# EAGLE design integrated-pico-fighting-board-gp2040-layout-Version3.0 (EAGLE 9.6.2)

## Sheet 1 of 2: MAIN CONNECTORS FOR THE PCB - Jasen Hicks
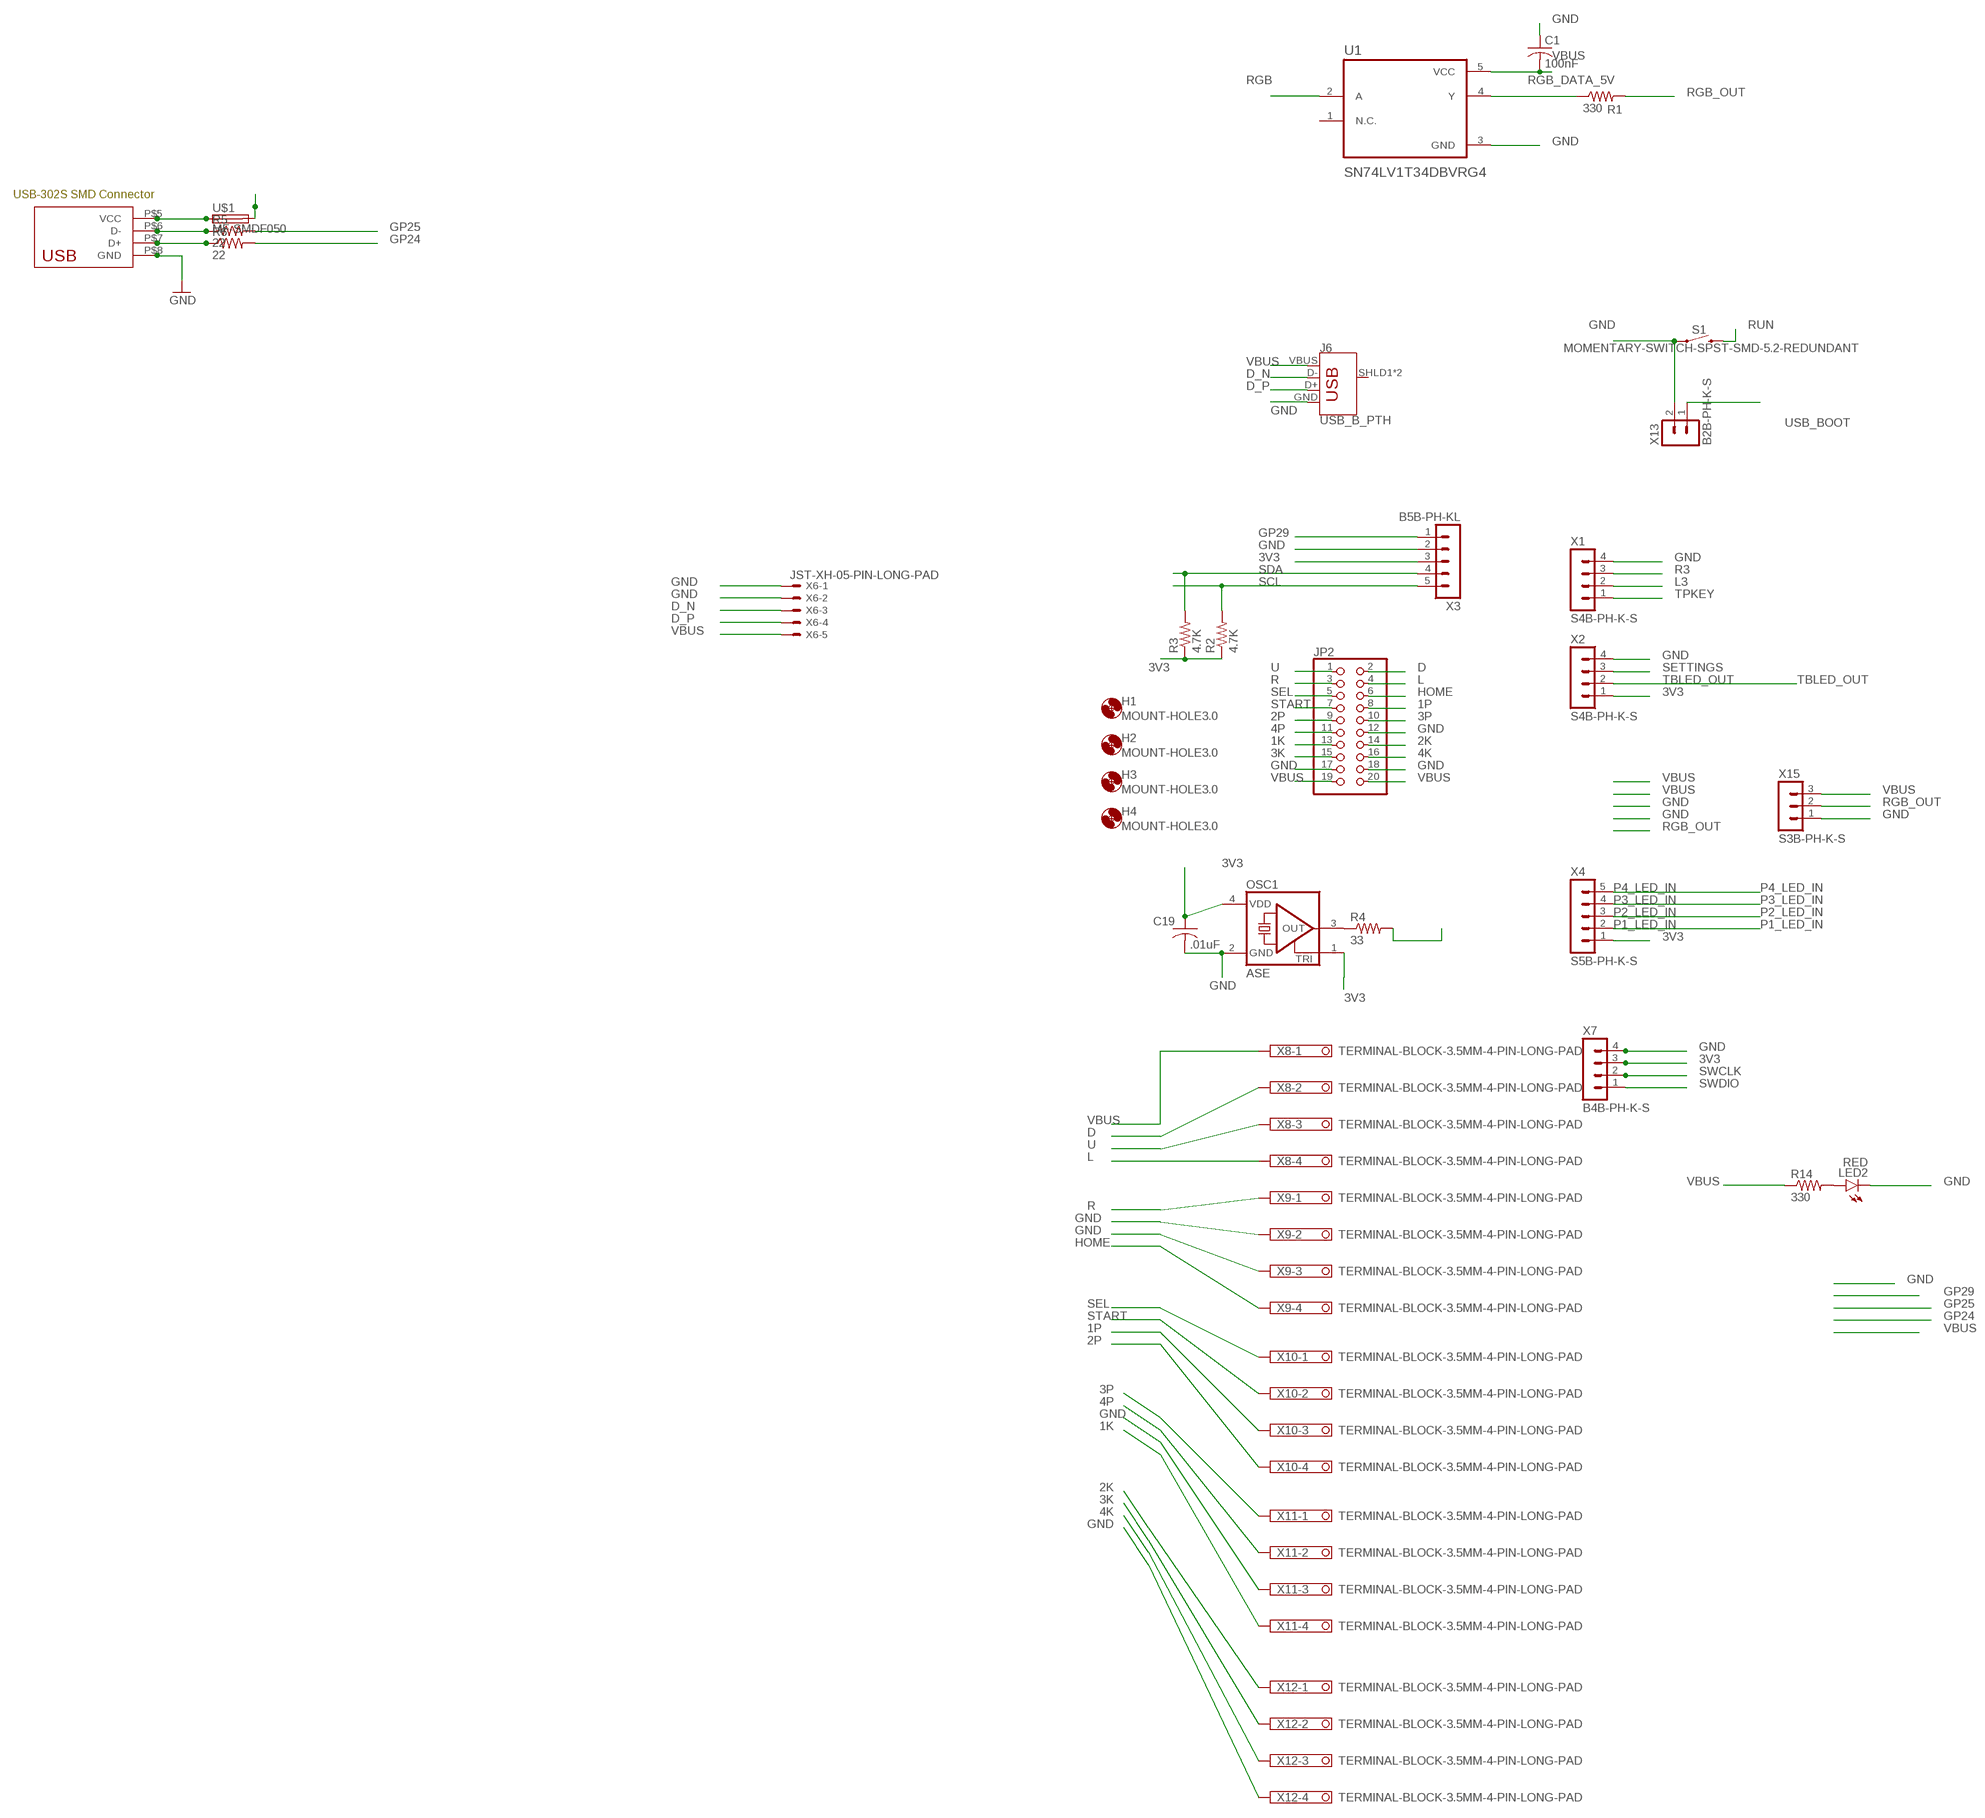
[diagram p0: schematic, sheet 1]

### Parts
C1  100nF  C-USC0603K  [C0603K]
C19  .01uF  C-USC0402K  [C0402K]
H1  MOUNT-HOLE3.0  [3,0]
H2  MOUNT-HOLE3.0  [3,0]
H3  MOUNT-HOLE3.0  [3,0]
H4  MOUNT-HOLE3.0  [3,0]
J6  USB_B_PTH  [USB-B-PTH]
JP2  PINHD-2X10  [2X10]
LED2  RED  LEDCHIP-LED0603  [CHIP-LED0603]
OSC1  ASE  [ASE]
R1  330  R-US_R0603  [R0603]
R2  4.7K  R-US_R0603  [R0603]
R3  4.7K  R-US_R0603  [R0603]
R4  33  R-US_R0402  [R0402]
R5  22  R-US_R0805  [R0805]
R6  22  R-US_R0805  [R0805]
R14  330  R-US_R0603  [R0603]
S1  MOMENTARY-SWITCH-SPST-SMD-5.2-REDUNDANT  [TACTILE_SWITCH_SMD_5.2MM]
U1  SN74LV1T34DBVRG4  [SOT95P280X145-5N]
U$1  MF-SMDF050  [MF-SMDF050]
U$2  USB-302S  [USB-302S]
X1  S4B-PH-K-S  [S4B-PH-K-S]
X2  S4B-PH-K-S  [S4B-PH-K-S]
X3  B5B-PH-KL  [B5B-PH-K-S]
X4  S5B-PH-K-S  [S5B-PH-K-S]
X6  JST-XH-05-PIN-LONG-PAD  [JST-XH-05-PACKAGE-LONG-PAD]
X7  B4B-PH-K-S  [B4B-PH-K-S]
X8  TERMINAL-BLOCK-3.5MM-4-PIN-LONG-PAD  [TERMINAL-BLOCK-4-PIN-3.5MM-LONG-PAD]
X9  TERMINAL-BLOCK-3.5MM-4-PIN-LONG-PAD  [TERMINAL-BLOCK-4-PIN-3.5MM-LONG-PAD]
X10  TERMINAL-BLOCK-3.5MM-4-PIN-LONG-PAD  [TERMINAL-BLOCK-4-PIN-3.5MM-LONG-PAD]
X11  TERMINAL-BLOCK-3.5MM-4-PIN-LONG-PAD  [TERMINAL-BLOCK-4-PIN-3.5MM-LONG-PAD]
X12  TERMINAL-BLOCK-3.5MM-4-PIN-LONG-PAD  [TERMINAL-BLOCK-4-PIN-3.5MM-LONG-PAD]
X13  B2B-PH-K-S  [B2B-PH-K-S]
X15  S3B-PH-K-S  [S3B-PH-K-S]

### Nets
1K: JP2.13 X11.4 ; also sheet 2
1P: JP2.8 X10.3 ; also sheet 2
2K: JP2.14 X12.1 ; also sheet 2
2P: JP2.9 X10.4 ; also sheet 2
3K: JP2.15 X12.2 ; also sheet 2
3P: JP2.10 X11.1 ; also sheet 2
3V3: C19.1 OSC1.1(TRI) OSC1.4(VDD) R2.1 R3.1 X2.1 X3.3 X4.1 X7.3 ; also sheet 2
4K: JP2.16 X12.3 ; also sheet 2
4P: JP2.11 X11.2 ; also sheet 2
D: JP2.2 X8.2 ; also sheet 2
D_N [diff pairs]: J6.D- X6.3 ; also sheet 2
D_P [diff pairs]: J6.D+ X6.4 ; also sheet 2
GND: C1.1 C19.2 J6.GND JP2.12 JP2.17 JP2.18 LED2.C OSC1.2(GND) S1.1 S1.2 U1.3(GND) U$2.P$8(GND) X1.4 X2.4 X3.2 X6.1 X6.2 X7.4 X9.2 X9.3 X11.3 X12.4 X13.2 X15.1 ; also sheet 2
GP24: R6.2 ; also sheet 2
GP25: R5.2 ; also sheet 2
GP29: X3.1 ; also sheet 2
HOME: JP2.6 X9.4 ; also sheet 2
L: JP2.4 X8.4 ; also sheet 2
L3: X1.2 ; also sheet 2
N$1: OSC1.3(OUT) R4.1
N$2: LED2.A R14.2
N$3: U$1.1 U$2.P$5(VCC)
N$4: R5.1 U$2.P$6(D-)
N$5: R6.1 U$2.P$7(D+)
P1_LED_IN: X4.2 ; also sheet 2
P2_LED_IN: X4.3 ; also sheet 2
P3_LED_IN: X4.4 ; also sheet 2
P4_LED_IN: X4.5 ; also sheet 2
R: JP2.3 X9.1 ; also sheet 2
R3: X1.3 ; also sheet 2
RGB: U1.2(A) ; also sheet 2
RGB_DATA_5V: R1.1 U1.4(Y)
RGB_OUT: R1.2 X15.2
RUN: S1.3 S1.4 ; also sheet 2
SCL: R2.2 X3.5 ; also sheet 2
SDA: R3.2 X3.4 ; also sheet 2
SEL: JP2.5 X10.1 ; also sheet 2
SETTINGS: X2.3 ; also sheet 2
START: JP2.7 X10.2 ; also sheet 2
SWCLK: X7.2 ; also sheet 2
SWDIO: X7.1 ; also sheet 2
TBLED_OUT: X2.2 ; also sheet 2
TPKEY: X1.1 ; also sheet 2
U: JP2.1 X8.3 ; also sheet 2
USB_BOOT: X13.1 ; also sheet 2
VBUS: C1.2 J6.VBUS JP2.19 JP2.20 R14.1 U1.5(VCC) U$1.2 X6.5 X8.1 X15.3 ; also sheet 2
XIN: R4.2 ; also sheet 2
Unconnected: J6.SHLD1(SHIELD) J6.SHLD2(SHIELD) U1.1(N.C.)

## Sheet 2 of 2: RP2040 Minimal Design based on https://datasheets.raspberrypi.com/rp2040/hardware-design-with-rp2040.pdf
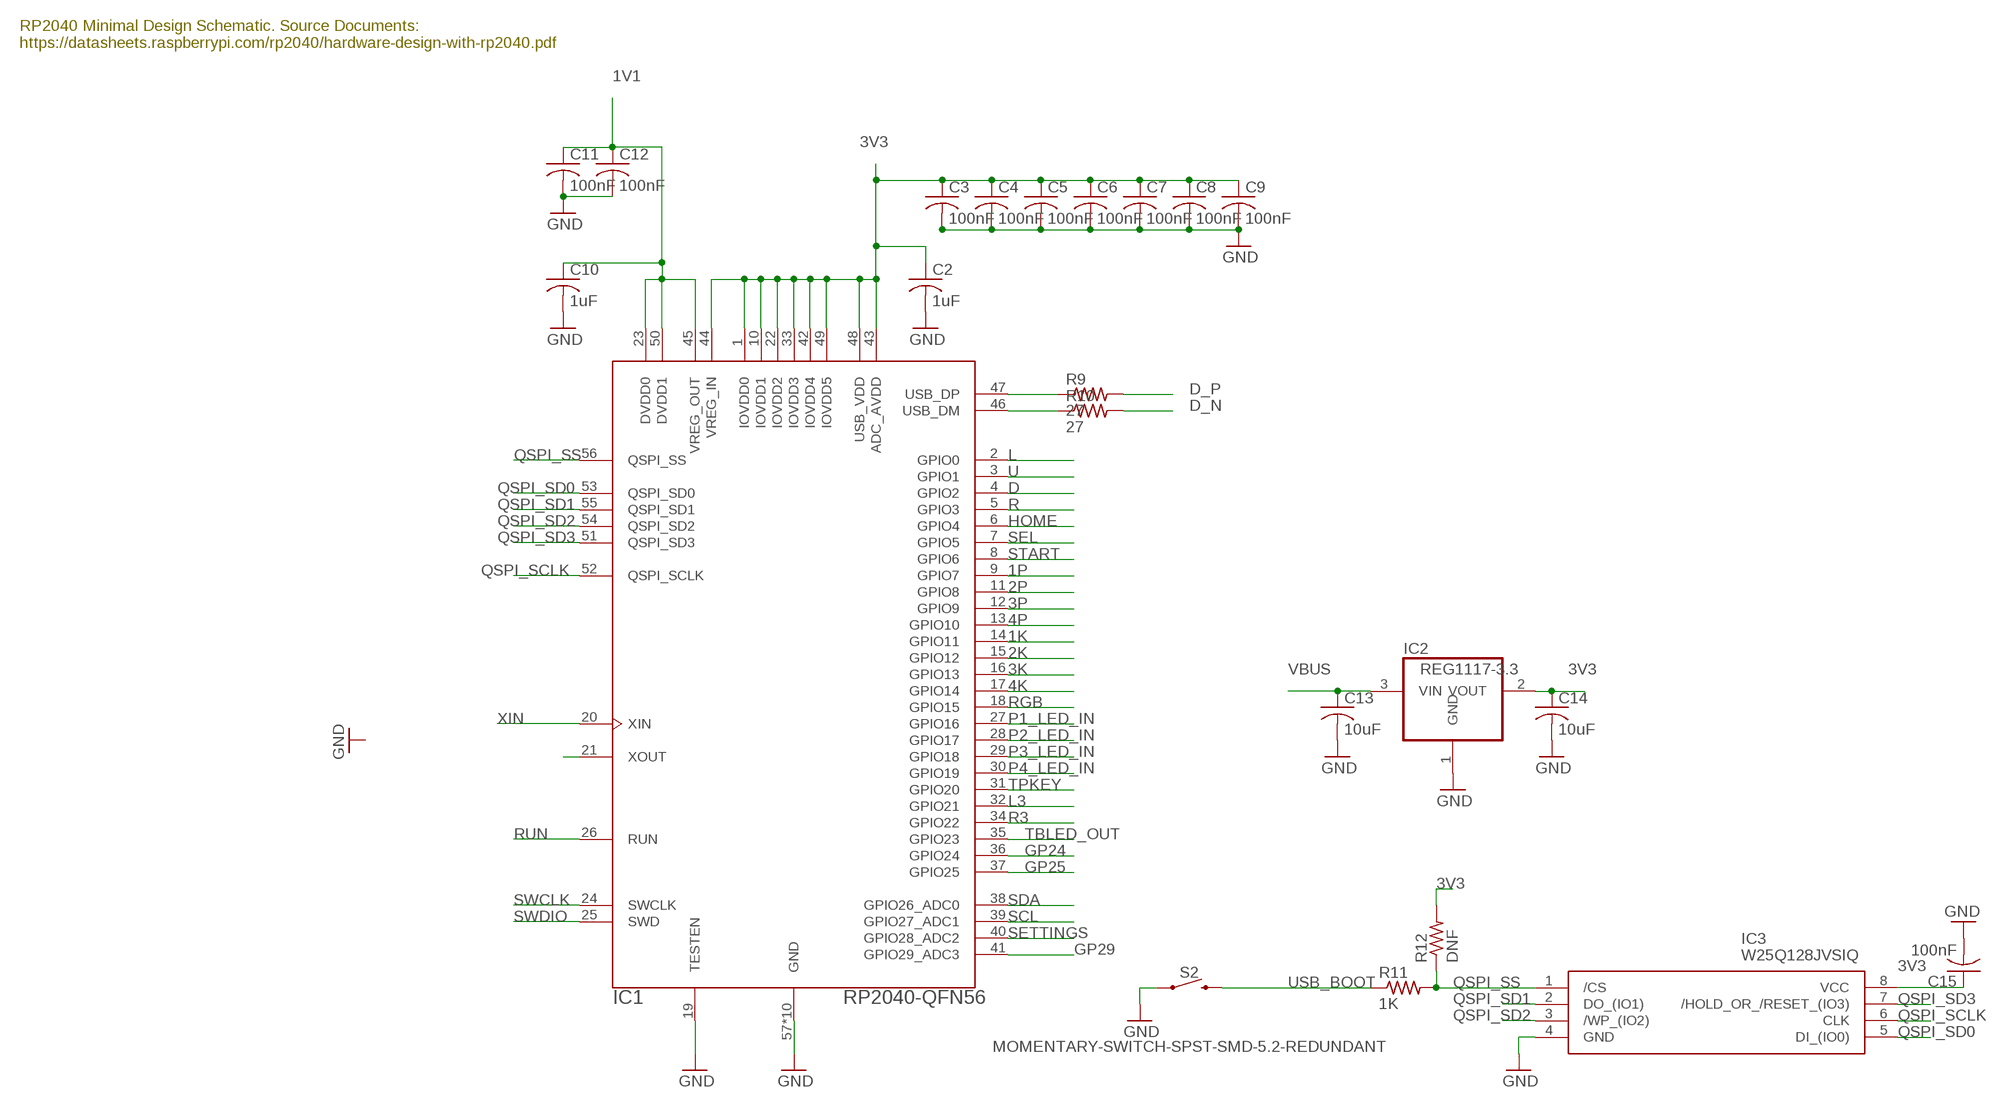
[diagram p1: schematic, sheet 2]

### Parts
C2  1uF  C-USC0402K  [C0402K]
C3  100nF  C-USC0402K  [C0402K]
C4  100nF  C-USC0402K  [C0402K]
C5  100nF  C-USC0402K  [C0402K]
C6  100nF  C-USC0402K  [C0402K]
C7  100nF  C-USC0402K  [C0402K]
C8  100nF  C-USC0402K  [C0402K]
C9  100nF  C-USC0402K  [C0402K]
C10  1uF  C-USC0402K  [C0402K]
C11  100nF  C-USC0402K  [C0402K]
C12  100nF  C-USC0402K  [C0402K]
C13  10uF  C-USC0402K  [C0402K]
C14  10uF  C-USC0402K  [C0402K]
C15  100nF  C-USC0402K  [C0402K]
IC1  RP2040-QFN56  [RP2040-QFN-56]
IC2  REG1117-3.3  REG1117  [SOT223]
IC3  W25Q128JVSIQ  [SOIC127P790X216-8N]
R9  27  R-US_R0402  [R0402]
R10  27  R-US_R0402  [R0402]
R11  1K  R-US_R0402  [R0402]
R12  DNF  R-US_R0402  [R0402]
S2  MOMENTARY-SWITCH-SPST-SMD-5.2-REDUNDANT  [TACTILE_SWITCH_SMD_5.2MM]

### Nets
1K: IC1.14(GPIO11) ; also sheet 1
1P: IC1.9(GPIO7) ; also sheet 1
1V1: C10.1 C11.1 C12.1 IC1.23(DVDD0) IC1.45(VREG_OUT) IC1.50(DVDD1)
2K: IC1.15(GPIO12) ; also sheet 1
2P: IC1.11(GPIO8) ; also sheet 1
3K: IC1.16(GPIO13) ; also sheet 1
3P: IC1.12(GPIO9) ; also sheet 1
3V3: C2.1 C3.1 C4.1 C5.1 C6.1 C7.1 C8.1 C9.1 C14.1 C15.1 IC1.1(IOVDD0) IC1.10(IOVDD1) IC1.22(IOVDD2) IC1.33(IOVDD3) IC1.42(IOVDD4) IC1.43(ADC_AVDD) IC1.44(VREG_IN) IC1.48(USB_VDD) IC1.49(IOVDD5) IC2.2(VOUT) IC3.8(VCC) R12.2 ; also sheet 1
4K: IC1.17(GPIO14) ; also sheet 1
4P: IC1.13(GPIO10) ; also sheet 1
D: IC1.4(GPIO2) ; also sheet 1
D_N [diff pairs]: R10.2 ; also sheet 1
D_P [diff pairs]: R9.2 ; also sheet 1
GND: C2.2 C3.2 C4.2 C5.2 C6.2 C7.2 C8.2 C9.2 C10.2 C11.2 C12.2 C13.2 C14.2 C15.2 IC1.19(TESTEN) IC1.57(GND) IC1.58(GND) IC1.59(GND) IC1.60(GND) IC1.61(GND) IC1.62(GND) IC1.63(GND) IC1.64(GND) IC1.65(GND) IC1.66(GND) IC2.1(GND) IC3.4(GND) S2.1 S2.2 ; also sheet 1
GP24: IC1.36(GPIO24) ; also sheet 1
GP25: IC1.37(GPIO25) ; also sheet 1
GP29: IC1.41(GPIO29_ADC3) ; also sheet 1
HOME: IC1.6(GPIO4) ; also sheet 1
L: IC1.2(GPIO0) ; also sheet 1
L3: IC1.32(GPIO21) ; also sheet 1
N$28: IC1.47(USB_DP) R9.1
N$29: IC1.46(USB_DM) R10.1
N$30: IC1.21(XOUT)
P1_LED_IN: IC1.27(GPIO16) ; also sheet 1
P2_LED_IN: IC1.28(GPIO17) ; also sheet 1
P3_LED_IN: IC1.29(GPIO18) ; also sheet 1
P4_LED_IN: IC1.30(GPIO19) ; also sheet 1
QSPI_SCLK: IC1.52(QSPI_SCLK) IC3.6(CLK)
QSPI_SD0: IC1.53(QSPI_SD0) IC3.5(DI_(IO0))
QSPI_SD1: IC1.55(QSPI_SD1) IC3.2(DO_(IO1))
QSPI_SD2: IC1.54(QSPI_SD2) IC3.3(/WP_(IO2))
QSPI_SD3: IC1.51(QSPI_SD3) IC3.7(/HOLD_OR_/RESET_(IO3))
QSPI_SS: IC1.56(QSPI_SS) IC3.1(/CS) R11.2 R12.1
R: IC1.5(GPIO3) ; also sheet 1
R3: IC1.34(GPIO22) ; also sheet 1
RGB: IC1.18(GPIO15) ; also sheet 1
RUN: IC1.26(RUN) ; also sheet 1
SCL: IC1.39(GPIO27_ADC1) ; also sheet 1
SDA: IC1.38(GPIO26_ADC0) ; also sheet 1
SEL: IC1.7(GPIO5) ; also sheet 1
SETTINGS: IC1.40(GPIO28_ADC2) ; also sheet 1
START: IC1.8(GPIO6) ; also sheet 1
SWCLK: IC1.24(SWCLK) ; also sheet 1
SWDIO: IC1.25(SWD) ; also sheet 1
TBLED_OUT: IC1.35(GPIO23) ; also sheet 1
TPKEY: IC1.31(GPIO20) ; also sheet 1
U: IC1.3(GPIO1) ; also sheet 1
USB_BOOT: R11.1 S2.3 S2.4 ; also sheet 1
VBUS: C13.1 IC2.3(VIN) ; also sheet 1
XIN: IC1.20(XIN) ; also sheet 1

### Notes on the sheet
- RP2040 Minimal Design Schematic. Source Documents:
  https://datasheets.raspberrypi.com/rp2040/hardware-design-with-rp2040.pdf

## Library data of the parts
C1-C15 C19 = rcl:C-US: CAPACITOR, American symbol; SPICEPREFIX: C
H1-H4 = holes:MOUNT-HOLE: MOUNTING HOLE with drill center marker
IC1 = RpiPico:RP2040-QFN56
IC2 = burr-brown:REG1117: 800mA and 1A Low Dropout (LDO) Positive Regulator 1.8V, 2.5V, 2.85V, 3.3V, 5V, and Adj; MPN: REG1117; OC_FARNELL: 1097566; OC_NEWARK: 14P6981
IC3 = SamacSys_Parts:W25Q128JVSIQ: 128M-bit Serial Flash Memory with uniform 4KB sectors and Dual/Quad SPI Source: Datasheet <https://www.winbond.com/hq/search-resource-file.jsp?partNo=W25Q128JVSIQ&type=datasheet>; ARROW_PART_NUMBER: W25Q128JVSIQ; ARROW_PRICE-STOCK: https://www.arrow.com/en/products/w25q128jvsiq/winbond-electronics?region=nac; DESCRIPTION: 128M-bit Serial Flash Memory with uniform 4KB sectors and Dual/Quad SPI; HEIGHT: 2.16mm; MANUFACTURER_NAME: Winbond; MANUFACTURER_PART_NUMBER: W25Q128JVSIQ; MOUSER_PART_NUMBER: 454-W25Q128JVSIQ; MOUSER_PRICE-STOCK: https://www.mouser.co.uk/ProductDetail/Winbond/W25Q128JVSIQ?qs=qSfuJ%252Bfl%2Fd6tLXvPR4fl9w%3D%3D
J6 = SparkFun-Connectors:USB_B: USB Type B Connector SparkFun Products: SparkFun Stepoko <https://www.sparkfun.com/products/13899> PTH; PROD_ID: CONN-08278; SF_ID: PRT-00139
JP2 = pinhead:PINHD-2X10: PIN HEADER
LED2 = led:LED: LED OSRAM: - CHIPLED LG R971, LG N971, LY N971, LG Q971, LY Q971, LO R971, LY R971 LH N974, LH R974 LS Q976, LO Q976, LY Q976 LO Q996 - Hyper CHIPLED LW Q18S LB Q993, LB Q99A, LB R99A - SideLED LS A670, LO A670, LY A670, LG A670, LP A670 LB A673, LV A673, LT A673, LW A673 LH A674 LY A675 LS A676, LA A676, LO A676, LY A676, LW A676 LS A679, LY A679, LG A679 - Hyper Micro SIDELED® LS Y876, LA Y876, LO Y876, LY Y876 LT Y87S - SmartLED LW L88C, LW L88S LB L89C, LB L89S, LG L890 LS L89K, LO L89K, LY L89K LS L896, LA L896, LO L896, LY L896 - TOPLED LS T670, LO T670, LY T670, LG T670, LP T670 LSG T670, LSP T670, LSY T670, LOP T670, LYG T670 LG T671, LOG T671, LSG T671 LB T673, LV T673, LT T673, LW T673 LH T674 LS T676, LA T676, LO T676, LY T676, LB T676, LH T676, LSB T676, LW T676 LB T67C, LV T67C, LT T67C, LS T67K, LO T67K, LY T67K, LW E67C LS E67B, LA E67B, LO E67B, LY E67B, LB E67C, LV E67C, LT E67C LW T67C LS T679, LY T679, LG T679 LS T770, LO T770, LY T770, LG T770, LP T770 LB T773, LV T773, LT T773, LW T773 LH T774 LS E675, LA E675, LY E675, LS T675 LS T776, LA T776, LO T776, LY T776, LB T776 LHGB T686 LT T68C, LB T68C - Hyper Mini TOPLED® LB M676 - Mini TOPLED Santana® LG M470 LS M47K, LO M47K, LY M47K Source: http://www.osram.convergy.de LUXEON: - LUMILED® LXK2-PW12-R00, LXK2-PW12-S00, LXK2-PW14-U00, LXK2-PW14-V00 LXK2-PM12-R00, LXK2-PM12-S00, LXK2-PM14-U00 LXK2-PE12-Q00, LXK2-PE12-R00, LXK2-PE12-S00, LXK2-PE14-T00, LXK2-PE14-U00 LXK2-PB12-K00, LXK2-PB12-L00, LXK2-PB12-M00, LXK2-PB14-N00, LXK2-PB14-P00, LXK2-PB14-Q00 LXK2-PR12-L00, LXK2-PR12-M00, LXK2-PR14-Q00, LXK2-PR14-R00 LXK2-PD12-Q00, LXK2-PD12-R00, LXK2-PD12-S00 LXK2-PH12-R00, LXK2-PH12-S00 LXK2-PL12-P00, LXK2-PL12-Q00, LXK2-PL12-R00 Source: www.luxeon.com KINGBRIGHT: KA-3528ASYC Source: www.kingbright.com
OSC1 = crystal:ASE: 3.3Vdc CMOS SMD CRYSTAL CLOCK OSCILLATOR SOurce: www.abracon.com; OC_FARNELL: unknown; OC_NEWARK: unknown
R1-R6 R9-R12 R14 = rcl:R-US_: RESISTOR, American symbol; SPICEPREFIX: R
S1 S2 = 3Ded-SparkFun-Switches:MOMENTARY-SWITCH-SPST: Momentary Switch (Pushbutton) - SPST Normally-open (NO) SPST momentary switches (buttons, pushbuttons). Variants PTH-12MM - 12mm square, through-hole Momentary Pushbutton Switch - 12mm Square <https://www.sparkfun.com/products/9190> (COM-09190) PTH-6.0MM, PTH-6.0MM-KIT - 6.0mm square, through-hole Mini Pushbutton Switch <https://www.sparkfun.com/products/97> (COM-00097) KIT package intended for soldering kit's - only one side of pads' copper is exposed. PTH-RIGHT-ANGLE-KIT - Right-angle, through-hole Right Angle Tactile Button <https://www.sparkfun.com/products/10791> - Used on SparkFun BigTime Watch Kit <https://www.sparkfun.com/products/11734> SMD-12MM - 12mm square, surface-mount Tactile Button - SMD (12mm) <https://www.sparkfun.com/products/12993> (COM-12993) Used on SparkFun PicoBoard <https://www.sparkfun.com/products/11888> SMD-4.5MM - 4.5mm Square Trackball Switch Used on SparkFun Blackberry Trackballer Breakout <https://www.sparkfun.com/products/13169> SMD-4.6MMX2.8MM - 4.60mm x 2.80mm, surface mount Used on SparkFun SAMD21 Mini Breakout <https://www.sparkfun.com/products/13664> SMD-5.2MM, SMD-5.2-REDUNDANT - 5.2mm square, surface-mount Mini Pushbutton Switch - SMD <https://www.sparkfun.com/products/8720> (COM-08720) Used on Arduino Pro Mini <https://www.sparkfun.com/products/11114> REDUNDANT package connects both switch circuits together SMD-6.0X3.5MM - 6.0 x 3.5mm, surface mount Momentary Reset Switch SMD <https://www.sparkfun.com/products/8229> (COM-08229) SMD-6.2MM-TALL - 6.2mm square, surface mount Tactile Button - SMD (6mm) <https://www.sparkfun.com/products/12992> Used on SparkFun Digital Sandbox <https://www.sparkfun.com/products/12651> SMD-RIGHT-ANGLE - Right-angle, surface mount Used on SparkFun Block for Intel® Edison - Arduino <https://www.sparkfun.com/products/13036>; PROD_ID: SWCH-08247; SF_SKU: COM-08720
U1 = SN74LV1T34DBVRG4:SN74LV1T34DBVRG4: Check availability <https://pricing.snapeda.com/parts/SN74LV1T34DBVRG4/Texas%20Instruments/view-part?ref=eda>; AVAILABILITY: In Stock; DESCRIPTION: Single Power Supply BUFFER Logic Level Shifter (no enable); MF: Texas Instruments; MP: SN74LV1T34DBVRG4; PACKAGE: SOT-23-5 Texas Instruments; PRICE: None; PURCHASE-URL: https://pricing.snapeda.com/search/part/SN74LV1T34DBVRG4/?ref=eda
U$1 = fuse:MF-SMDF: MF-SMDF Series - PRC Resettable Fuses Source: http://www.farnell.com/datasheets/716597.pdf
U$2 = USB-302S:USB-302S
X1 X2 = con-JST PH:S4B-PH: JST PH series header 2.00mm pitch disconnectable crimp style connectors, horizontal (side entry type), 4 pins
X3 = con-JST PH:B5B-PH: JST PH series header 2.00mm pitch disconnectable crimp style connectors, vertical (side entry type), 5 pins
X4 = con-JST PH:S5B-PH: JST PH series header 2.00mm pitch disconnectable crimp style connectors, horizontal (side entry type), 5 pins
X6 = Rembrandt Electronics - JST XH Connectors v1-0:JST-XH-05-PIN: JST XH Connector 2 Pin Wire to board connector. Pitch: 2,54 mm, (0.100") Number of pins: 5 Created by Rembrandt Electronics www.rembrandtelectronics.com
X7 = con-JST PH:B4B-PH: JST PH series header 2.00mm pitch disconnectable crimp style connectors, vertical (side entry type), 4 pins
X8-X12 = Rembrandt Electronics - Terminal Block 3-5mm v1-0:TERMINAL-BLOCK-3.5MM-4-PIN: Terminal Block 3.5mm Pitch: 3,5 mm Number of pins: 4 Created by Rembrandt Electronics www.rembrandtelectronics.com
X13 = con-JST PH:B2B-PH: JST PH series header 2.00mm pitch disconnectable crimp style connectors, vertical (side entry type), 2 pins
X15 = con-JST PH:S3B-PH: JST PH series header 2.00mm pitch disconnectable crimp style connectors, horizontal (side entry type), 3 pins

## Net classes
1 diff pairs: width 0.8 mm, clearance 0.15 mm

## Board
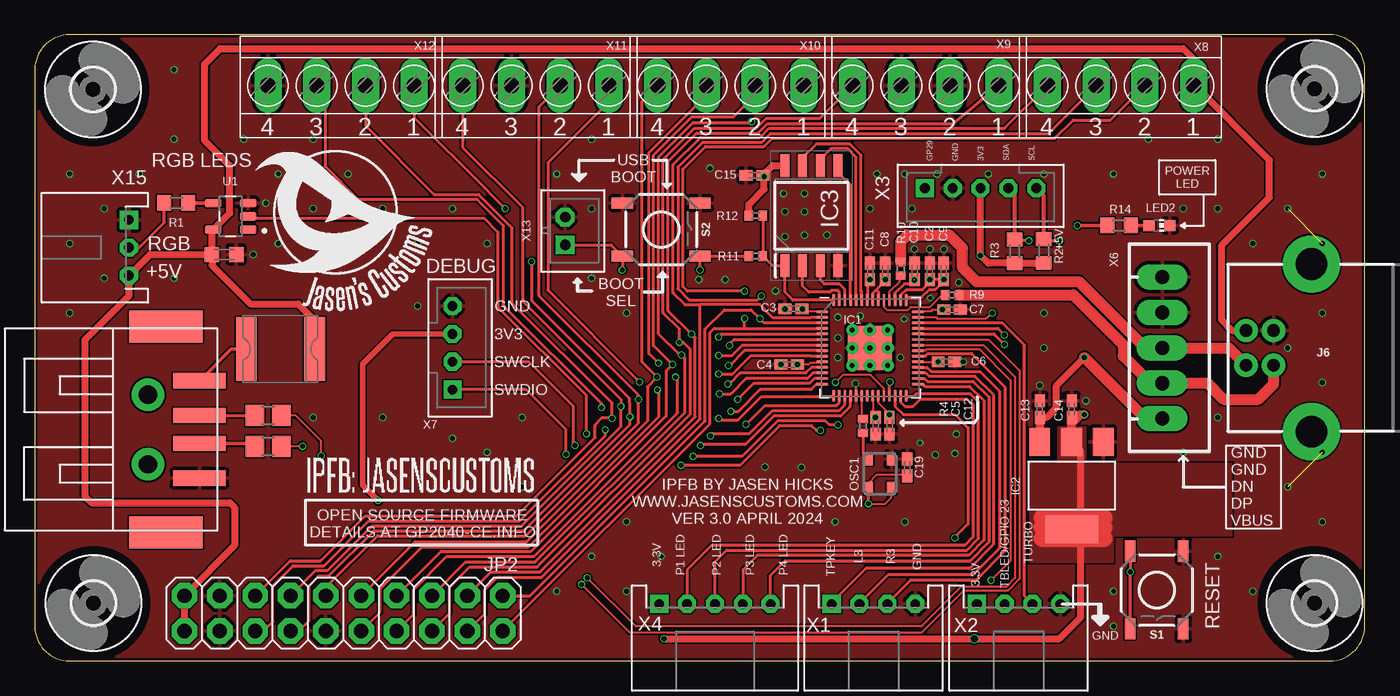
[diagram p2: board, top side]
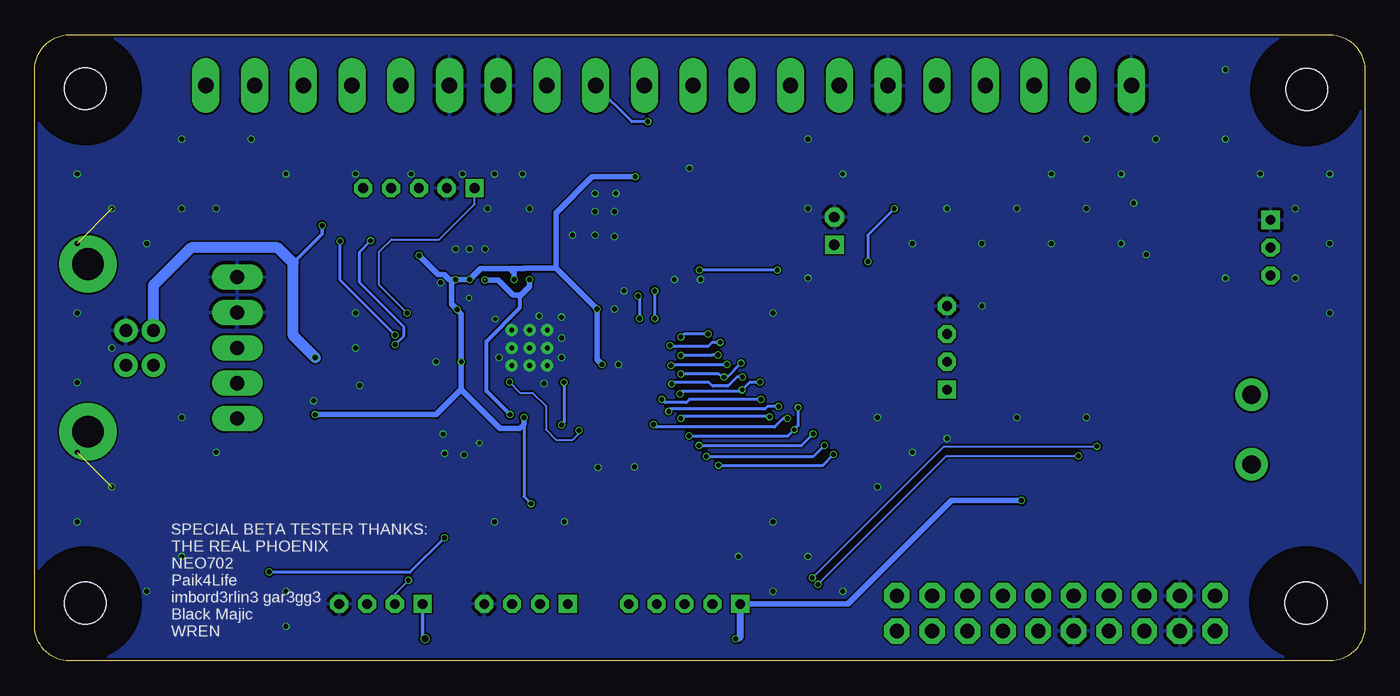
[diagram p3: board, bottom side, seen from below]

Size 95.54 x 45 mm. Coordinates in mm from the lower left corner, seen from the top.
Outline: 0,42.5 0,2.5 arc90 2.5,0 93.04,0 arc90 95.54,2.5 95.54,42.5 arc90 93.04,45 2.5,45 arc90 0,42.5
Copper layers (1*16): Top 0.035mm / dielectric 1.6mm / Bottom 0.035mm
Design rules "jlcpcb-2layers": minimum track width 5mil, minimum drill 0.3mm, track to track 5mil, track to pad 5mil, pad to pad 5mil, via to via 5mil, smd to smd 5mil, copper to edge 0.2mm, drill to drill 6mil, minimum pad ring 10mil, minimum via ring 3mil, stop-mask expansion 4mil, vias tented up to drill 0mil, thermal gap 10mil

### Footprints (pad centres in the part's own frame; a part is rotated, then mirrored left to right if it is on the bottom)
C0603K = smd 1.05 x 1.08: 1 -0.875,0; 2 0.875,0
C0402K = smd 0.925 x 0.74: 1 -0.6,0; 2 0.6,0
3,0 = hole 3: 0,0
RP2040-QFN-56 = smd 0.875 x 0.2: 1 -3.438,2.6; 2 -3.438,2.2; 3 -3.438,1.8; 4 -3.438,1.4; 5 -3.438,1; 6 -3.438,0.6; 7 -3.438,0.2; 8 -3.438,-0.2; 9 -3.438,-0.6; 10 -3.438,-1; 11 -3.438,-1.4; 12 -3.438,-1.8; 13 -3.438,-2.2; 14 -3.438,-2.6; 29 3.438,-2.6; 30 3.438,-2.2; 31 3.438,-1.8; 32 3.438,-1.4; 33 3.438,-1; 34 3.438,-0.6; 35 3.438,-0.2; 36 3.438,0.2; 37 3.438,0.6; 38 3.438,1; 39 3.438,1.4; 40 3.438,1.8; 41 3.438,2.2; 42 3.438,2.6 | smd 0.2 x 0.875: 15 -2.6,-3.438; 16 -2.2,-3.438; 17 -1.8,-3.438; 18 -1.4,-3.438; 19 -1,-3.438; 20 -0.6,-3.438; 21 -0.2,-3.438; 22 0.2,-3.438; 23 0.6,-3.438; 24 1,-3.438; 25 1.4,-3.438; 26 1.8,-3.438; 27 2.2,-3.438; 28 2.6,-3.438; 43 2.6,3.438; 44 2.2,3.438; 45 1.8,3.438; 46 1.4,3.438; 47 1,3.438; 48 0.6,3.438; 49 0.2,3.438; 50 -0.2,3.438; 51 -0.6,3.438; 52 -1,3.438; 53 -1.4,3.438; 54 -1.8,3.438; 55 -2.2,3.438; 56 -2.6,3.438 | smd 3.2 x 3.2: 57 0,0 | drill 0.35 pad 0.6: 58 -1.275,1.275; 59 0,1.275; 60 1.275,1.275; 61 -1.275,0; 62 0,0; 63 1.275,0; 64 -1.275,-1.275; 65 0,-1.275; 66 1.275,-1.275
SOT223 = smd 1.499 x 2.007: 1 -2.261,-3.15; 2 0.025,-3.15; 3 2.311,-3.15 | smd 3.81 x 2.007: 4 0,3.15
SOIC127P790X216-8N = smd 1.65 x 0.65: 1 -3.6,1.905; 2 -3.6,0.635; 3 -3.6,-0.635; 4 -3.6,-1.905; 5 3.6,-1.905; 6 3.6,-0.635; 7 3.6,0.635; 8 3.6,1.905
USB-B-PTH = drill 0.914 pad 1.676: D+ 4,1.25; D- 5.981,1.25; GND 4,-1.25; VBUS 5.981,-1.25 | drill 2.286: SHLD1 1.282,-6.02; SHLD2 1.282,6.02
2X10 = drill 1.016 octagon: 1 -11.43,-1.27; 2 -11.43,1.27; 3 -8.89,-1.27; 4 -8.89,1.27; 5 -6.35,-1.27; 6 -6.35,1.27; 7 -3.81,-1.27; 8 -3.81,1.27; 9 -1.27,-1.27; 10 -1.27,1.27; 11 1.27,-1.27; 12 1.27,1.27; 13 3.81,-1.27; 14 3.81,1.27; 15 6.35,-1.27; 16 6.35,1.27; 17 8.89,-1.27; 18 8.89,1.27; 19 11.43,-1.27; 20 11.43,1.27
CHIP-LED0603 = smd 0.8 x 0.8: A 0,-0.75; C 0,0.75
ASE = smd 0.9 x 0.65: 1 -1.05,-0.825; 2 1.05,-0.825; 3 1.05,0.825; 4 -1.05,0.825
R0603 = smd 1 x 1.1: 1 -0.85,0; 2 0.85,0
R0402 = smd 0.6 x 0.7: 1 -0.5,0; 2 0.5,0
R0805 = smd 1.3 x 1.5: 1 -0.95,0; 2 0.95,0
TACTILE_SWITCH_SMD_5.2MM = smd 1.524 x 0.762: 1 -2.794,1.905; 2 2.794,1.905; 3 -2.794,-1.905; 4 2.794,-1.905
SOT95P280X145-5N = smd 1.21 x 0.59: 1 -1.255,0.95; 2 -1.255,0; 3 -1.255,-0.95; 4 1.255,-0.95; 5 1.255,0.95
MF-SMDF050 = smd 1.5 x 4.6: 1 -2.45,0; 2 2.45,0
USB-302S = drill 1.3: P$1 -2.5,0; P$2 2.5,0 | smd 2.3 x 5.3: P$3 -7.4,1.3; P$4 7.4,1.3 | smd 1.1 x 3.8: P$5 -3.5,3.7; P$6 -1,3.7; P$7 1,3.7; P$8 3.5,3.7
S4B-PH-K-S = drill 0.7 pad 1.3 square: 1 3,0 | drill 0.7 pad 1.3 octagon: 2 1,0; 3 -1,0; 4 -3,0
B5B-PH-K-S = drill 0.7 pad 1.3 square: 1 4,0 | drill 0.7 pad 1.3 octagon: 2 2,0; 3 0,0; 4 -2,0; 5 -4,0
S5B-PH-K-S = drill 0.7 pad 1.3 square: 1 4,0 | drill 0.7 pad 1.3 octagon: 2 2,0; 3 0,0; 4 -2,0; 5 -4,0
JST-XH-05-PACKAGE-LONG-PAD = drill 1.016 long: 1 -5.08,0; 2 -2.54,0; 3 0,0; 4 2.54,0; 5 5.08,0
B4B-PH-K-S = drill 0.7 pad 1.3 square: 1 3,0 | drill 0.7 pad 1.3 octagon: 2 1,0; 3 -1,0; 4 -3,0
TERMINAL-BLOCK-4-PIN-3.5MM-LONG-PAD = drill 1.1 pad 1.7 long: 1 -5.25,-0.1; 2 -1.75,-0.1; 3 1.75,-0.1; 4 5.25,-0.1
B2B-PH-K-S = drill 0.75 pad 1.3 square: 1 1,0 | drill 0.75 pad 1.3 octagon: 2 -1,0
S3B-PH-K-S = drill 0.7 pad 1.3 square: 1 2,0 | drill 0.7 pad 1.3 octagon: 2 0,0; 3 -2,0

### Placement (x,y rotation side)
C1  13.6,29.21 180 top
C2  64.3,28 90 top
C3  54.5,25.3 180 top
C4  54.2,21.3 180 top
C5  60.4,16.9 270 top
C6  65.5,21.5 0 top
C7  65.9,25.25 0 top
C8  61.1,28 90 top
C9  65.3,28 90 top
C10  63.2,28 90 top
C11  60,28 90 top
C12  61.4,16.9 270 top
C13  72.2,18.1 90 top
C14  74.5,18.1 90 top
C15  51.7,34.9 180 top
C19  62.67,13.91 90 top
H1  4.22,4.17 0 top
H2  91.92,4.17 0 top
H3  4.17,41.07 0 top
H4  91.92,41.12 0 top
IC1  60,22.5 0 top
IC2  74.5,12.6 180 top
IC3  55.8,32 90 top
J6  93,22.5 180 top
JP2  22.18,3.42 180 top
LED2  80.8,31.3 270 top
OSC1  60.71,13.46 90 top
R1  10.16,32.92 180 top
R2  72.48,29.46 90 top
R3  70.39,29.44 90 top
R4  59.5,16.89 90 top
R5  16.76,17.65 0 top
R6  16.76,15.43 0 top
R9  65.9,26.3 0 top
R10  62.2,28.2 90 top
R11  51.8,29.1 0 top
R12  51.8,32 180 top
R14  77.9,31.3 0 top
S1  80.6,5.1 270 top
S2  45,31 0 top
U1  14.07,31.95 180 top
U$1  17.65,22.42 0 top
U$2  8.13,16.64 270 top
X1  60.25,4.1 180 top
X2  70.67,4.1 180 top
X3  67.94,33.97 180 top
X4  48.86,4.1 180 top
X6  81,22.5 270 top
X7  30,22.5 270 top
X8  78,41.25 180 top
X9  64,41.25 180 top
X10  50,41.25 180 top
X11  36,41.25 180 top
X12  22,41.25 180 top
X13  38.1,30.9 270 top
X15  6.77,29.7 90 top

### Tracks (layer width: path | path; a pad name or v marks a point on that pad's centre or on a via)
1K  (via drill 0.35)
  Top 0.2: JP2.13 20.18,6.5 21.02,6.5 24.23,9.71 34.96,9.71 42.1,16.84 v42.1,18.3 42.1,18.8 35.05,25.85 35.05,32.6 30.75,36.9 X11.4 | v50,17.94 50.54,17.94 52.1,19.5 55.76,19.5 56.16,19.9 IC1.14
  Bottom 0.2: v42.1,18.3 42.9,18.3 43.1,18.1 49.9,18.1 50,18 v50,17.94
1P  (via drill 0.35)
  Top 0.2: JP2.8 27.2,3.36 27.2,5.1 29.6,7.5 35.85,7.5 46.17,17.82 46.17,20.39 v46.03,20.39 | v49.13,20.63 49.19,20.57 50.07,20.57 51.44,21.95 55.72,21.95 55.76,21.9 IC1.9 | v44.8,21.4 44.12,22.08 44.12,36.52 48.25,40.65 X10.3
  Bottom 0.2: v49.13,20.63 46.43,20.63 46.19,20.39 v46.03,20.39 46.02,20.38 45.83,20.38 v44.81,21.4 v44.8,21.4
1V1  (via drill 0.35)  (1 unrouted)
  Top 0.152: v61.4,17.7 61.4,17.76 60.6,18.56 IC1.23
  Top 0.2: C11.1 59.8,27.2 IC1.50 | IC1.45 61.8,26.44 62.46,27.1 62.9,27.1 C10.1
  Top 0.61: C12.1 v61.4,17.7
  Bottom 0.28: 60.7,26.2 60.7,25.37 63.1,22.97 63.1,19.4 v61.4,17.7
  Bottom 0.406: C11.1 60,26.9 60.6,26.3 | v63.2,27.36 62.25,27.36 61.18,26.3 60.6,26.3 | 60.6,26.3 60.7,26.2
  other vias: 60,27.4
2K  (via drill 0.35)
  Top 0.2: JP2.14 18.95,2.15 19.7,2.9 19.7,5.4 20.4,6.1 21.12,6.1 24.37,9.35 35.11,9.35 42.75,16.99 v42.75,17.55 42.75,18.53 42.74,18.54 42.74,18.86 35.7,25.9 v35.7,28.7 | v49.13,17.44 49.28,17.29 50.49,17.29 52.16,18.96 57.3,18.96 IC1.15 | v33.8,32.5 32.9,33.4 32.3,34 27.25,39.05 X12.1
  Bottom 0.2: v49.13,17.44 48.97,17.6 42.8,17.6 v42.75,17.55 | v33.8,32.5 35.7,30.6 v35.7,28.7
2P  (via drill 0.35)
  Top 0.2: JP2.9 27.32,8.56 35.32,8.56 44,17.25 44,19.7 v44.7,20.4 43.61,21.49 43.61,40.21 X10.4 | v49.78,19.9 49.9,19.9 50.67,20.68 55.38,20.68 55.8,21.1 IC1.11
  Bottom 0.2: v44.7,20.4 45.1,20.4 45.75,19.75 46.85,19.75 47.1,20 49.69,20 v49.78,19.9
3K  (via drill 0.35)
  Top 0.2: JP2.15 18.34,7.21 20.53,7.21 23.74,10.41 34.61,10.41 40.25,16.05 40.25,16.98 40.72,17.45 41.44,17.45 v41.47,17.42 41.47,18.53 34.3,25.7 34.3,31.11 31.88,33.53 28.7,33.53 23.75,38.48 X12.2 | v51.1,17 52.44,18.35 57.6,18.35 57.8,18.55 IC1.16
  Bottom 0.2: v41.47,17.42 41.78,17.42 42.39,16.81 50.9,16.81 v51.1,17
3P  (via drill 0.35)
  Top 0.2: JP2.10 24.8,3.5 24.8,5.2 27.81,8.21 35.46,8.21 44.83,17.57 44.83,19.38 v44.72,19.49 | v49.2,19.2 50,19.2 51.1,20.3 55.5,20.3 55.9,20.7 IC1.12 | v43.45,20.05 36.86,26.64 36.86,35.8 41.25,40.19 X11.1
  Bottom 0.2: v49.2,19.2 49.01,19.39 44.82,19.39 v44.72,19.49 44.44,19.77 44.16,20.05 v43.45,20.05
3V3  (via drill 0.35, 0.5)  (1 unrouted)
  Top 0.152: 60.9,27.2 C8.1 | IC1.33 C6.1 | IC1.22 60.2,17.7 C5.1 | 55.16,21.5 54.96,21.3 C4.1 55.57,21.3 55.67,21.4 56.47,21.4 IC1.10 | IC1.1 55.3,25.1 C3.1 | IC1.42 63.5,25.16 64.44,25.16 64.53,25.25 65,25.25 v65.2,25.25 | OSC1.4 59.88,12.76 60.52,13.4 62.58,13.4 C19.1 | v59.88,11.3 61.09,11.3 61.53,11.75 OSC1.1
  Top 0.2: 62.2,26.2 IC1.44 62.2,26.29 62.6,26.68 63.77,26.68 64.49,27.4 C9.1 65.3,27.2 65.13,27.03 65.02,27.03 64.69,26.7 64.27,26.7 63.71,26.14 62.6,26.14 IC1.43 | 60.2,26.14 IC1.49 60.2,26.44 60.43,26.67 | 60.43,26.67 60.6,26.5 IC1.48 | 60.43,26.67 60.45,26.68 60.48,26.68 60.9,27.11 60.9,27.2 | 62.54,13.05 62.54,13.17 C19.1 | v59.88,11.3 OSC1.4
  Top 0.254: C7.1 65,25.25
  Top 0.406: v24.66,11.54 23.56,12.64 23.56,21.34 25.72,23.5 X7.3
  Top 0.508: v45.2,1.6 v67.5,1.6 73.6,1.6 75.1,3.1 75.1,15.12 IC2.2 | IC3.8 53,35.6 C15.1 v52.4,34.8 52.4,33.9 51.3,32.8 R12.2 | R2.1 72.46,28.59 R3.1 68.5,28.59 v67.94,29.15 X3.3
  Top 0.61: C14.1 74.47,17.48 IC2.2 74.47,17.07 75.1,17.7 v75.4,17.7 | C3.1 55.12,25.28 v55.15,25.28
  Top 1.27: 76.8,8.8 72.4,8.8 | 76.8,9.6 72.4,9.6 | 76.8,10.3 72.4,10.3
  Bottom 0.2: C5.1 60.4,11.82 v59.88,11.3
  Bottom 0.254: v67.5,1.6 67.67,1.77 X2.1
  Bottom 0.406: C9.1 65.4,27.4 65.6,27.2 65.6,25.65 v65.2,25.25 64.9,24.95 C6.1 64.9,19.5 | C9.1 C2.1 63.5,28.2 61.4,28.2 | 61.4,28.2 61.1,27.9 C8.1 | 61.4,28.2 60.38,28.2 60.35,28.23 58.1,28.23 | 58.1,28.23 v55.15,25.28 55.15,21.66 v54.8,21.31 | C5.1 60.4,17 60.7,16.7 62.1,16.7 64.9,19.5 | 64.9,19.5 66.7,17.7 v75.4,17.7 | 58.1,28.23 58.1,28.24 58.1,32.2 55.5,34.8 v52.4,34.8 | v24.66,11.54 29.67,11.54 37.11,4.1 X4.1 | v67.94,29.15 66.57,27.77 66.14,27.77 65.77,27.4 C9.1
  Bottom 0.508: X4.1 44.86,1.74 45,1.6 v45.2,1.6
  other vias: 64.9,21.5 65.3,27.4 64.3,27.4 61.1,27.4 60.4,17.5
  pour Top (no thermals): 71.5,7.1 71.5,14.2 73.5,14.2 73.5,16.8 75.5,16.8 75.5,14.2 86,14.2 86,9 77.5,9 77.5,7.1
4K  (via drill 0.35)
  Top 0.2: JP2.16 16.45,2.15 17.1,2.8 17.1,5.4 18.55,6.85 20.78,6.85 23.98,10.06 34.82,10.06 40.98,16.22 v40.98,16.62 | v48.53,16.18 48.69,16.33 51.33,16.33 53,18 57.8,18 58.2,18.4 IC1.17 | v40.7,18.2 40.7,18.5 33.65,25.55 33.65,31.3 31.75,33.2 23.2,33.2 20.85,35.55 20.85,40.75 X12.3
  Bottom 0.2: v40.98,16.62 41,16.62 | v48.53,16.18 41.44,16.18 41,16.62 | v40.7,18.2 40.7,16.92 41,16.62
4P  (via drill 0.35)
  Top 0.2: JP2.11 20.91,5.29 24.62,9 35.26,9 43.38,17.12 v43.38,18.79 v43.37,18.8 43.37,19.1 36.23,26.24 36.23,39.83 X11.2 | v50.5,18.8 51.64,19.95 55.64,19.95 56,20.3 IC1.13
  Bottom 0.2: v43.37,18.8 48.51,18.8 48.74,18.57 50.26,18.57 v50.5,18.8
D  (via drill 0.35)
  Top 0.2: JP2.2 48.5,17.04 48.5,23.6 48.8,23.9 51,23.9 | 51,23.9 IC1.4 | 51,23.9 v51,24.6 | v51,26.58 46.87,26.58 46.56,26.9 46.56,35.36 48.16,36.97 52.38,36.97 52.98,37.57 73.3,37.57 74.6,38.88 77.28,38.88 X8.2
  Bottom 0.2: v51,24.6 v51,26.58
D_N
  Top 0.8: R10.2 62.2,30.11 62.7,30.61 65.7,30.61 66.65,29.67 66.65,28.27 67.66,27.25 70.93,27.25 75.01,27.25 79.77,22.5 X6.3 85.77,22.5 J6.D-
D_P
  Top 0.8: R9.2 74.6,26.3 78.2,22.7 78.2,21.9 80.14,19.96 X6.4 84.24,19.96 85.4,18.8 87.9,18.8 89,19.9 J6.D+
GND  (via drill 0.3, 0.35)  (2 unrouted)
  Top 0.152: IC1.19 59,19.94 58.99,19.95 v58.95,19.95
  Top 0.2: C4.2 v53.6,21.31 | C6.2 v66.7,21.5
  other vias: 53.9,25.3 64.7,14.8 66.1,14.9 66.2,16.3 47.7,27.4 49.6,27.4 53.2,26.6 48.5,35.4 53.8,33.6 55.3,33.6 55.3,32.3 53.9,32.3 53.9,30.5 55.3,30.6 56.9,30.6 57.7,24.7 59.3,24.8 57.7,23.2 57.7,21.8 62.2,21.8 10,42.5 10,37.5 7.5,35 2.5,35 5,32.5 2.5,30 5,27.5 2.5,25 17.5,30 22.5,30 27.5,30 27.5,25.5 10,27.5 20,17.5 25,17.5 32.5,15 35,12.5 35,17.5 30,16 55.07,13.91 42.5,10 40,7.5 37.5,5 45,7.5 42.5,5 52.45,13.95 57.5,10 62.5,10 15,37.5 17.5,35 20,37.5 22.5,35 25,32.5 20,32.5 30,32.5 37.5,35 40,37.5 40,32.5 40,27.5 42.5,25 32.5,30 62.5,35 72.5,35 80,37.5 77.5,35 63,32.5 60,32.5 82.5,32.5 85,32.5 85,37.5 92.5,25 90,22.5 92.5,20 92.5,30 90,32.5 92.5,35 87.5,30 92.5,15 90,12.5 92.5,10 85,17.5 82.5,15 72.5,25 72.5,22.5 87.5,5 85,7.5 77.5,5 77.5,2.5 15.7,29.2 16.6,32.9 63.2,29.6 64.3,29.6 65.3,29.6 72.2,19.8 75.5,18.7 66.38,27.19 64.34,26.08 62.46,24.58 63.6,15.67 68.5,35 64.8,35 60.5,35
  pour Top (rank 2): 0,0 0,45 95.25,45 95.25,0
  pour Bottom: 0,0 0,45 95.25,45 95.25,0
GP24  (via drill 0.35)
  Top 0.152: IC1.36 68.14,22.7 70.42,20.42 70.42,5.97 69.79,5.33 66.55,5.33 63.69,2.48 43.18,2.48 v39.69,5.97 | v19.24,15.43 R6.2
  Bottom 0.152: v39.69,5.97 30.23,15.43 v19.24,15.43
GP25  (via drill 0.35)
  Top 0.152: IC1.37 68.5,23.1 70.74,20.86 70.74,5.89 69.9,5.05 66.73,5.05 63.73,2.06 42.71,2.06 v39.27,5.49 | v20.57,14.73 20.57,15.81 18.73,17.65 R5.2
  Bottom 0.152: v39.27,5.49 30.03,14.73 v20.57,14.73
GP29  (via drill 0.35)
  Top 0.152: IC1.41 64.74,24.7 64.83,24.6 68.3,24.6 v68.8,25
  Bottom 0.152: v68.8,25 70.8,27 70.8,29.4 69.91,30.29 66.48,30.29 63.94,32.83 X3.1
HOME  (via drill 0.35)
  Top 0.2: JP2.6 29.8,3.42 29.8,5.3 31.25,6.75 36.1,6.75 47.09,17.74 47.09,22.4 46.59,22.9 v46.3,22.9 46.3,23.87 45.15,25.02 45.15,36.02 47.4,38.27 51.84,38.27 52.56,39 56.4,39 X9.4 | v49.9,22.66 49.9,22.76 50.24,23.1 IC1.6
  Bottom 0.2: v46.3,22.9 46.87,22.9 47.13,22.64 49.88,22.64 v49.9,22.66
L
  Top 0.2: JP2.4 32.3,3.38 32.3,5.1 33.2,6 36.4,6 47.8,17.39 47.8,25.59 47.8,25.6 | IC1.2 55.76,24.7 55.72,24.65 53.05,24.65 52.1,25.6 47.8,25.6 | 47.8,25.6 46.7,25.6 45.85,26.45 45.85,35.65 47.82,37.62 52.11,37.62 52.76,38.27 69.67,38.27 X8.4
L3
  Top 0.2: IC1.32 64.1,21.1 64.4,20.8 67.9,20.8 69.3,19.4 69.3,8.1 67.4,6.2 61.3,6.2 59.25,4.15 X1.2
N$1
  Top 0.2: R4.1 59.5,14.89 OSC1.3
N$2
  Top 0.254: R14.2 LED2.A
N$3
  Top 0.254: U$2.P$5 14.11,22.42 U$1.1
N$4
  Top 0.203: U$2.P$6 11.84,17.65 R5.1
N$5
  Top 0.254: U$2.P$7 15.61,15.64 R6.1
N$28
  Top 0.152: IC1.47 61,25.44 61.23,25.21 62.71,25.21 62.94,25.44 64.32,25.44 65.18,26.3 R9.1
N$29
  Top 0.152: R10.1 62.1,27.6 62.1,27.24 61.4,26.54 IC1.46
P1_LED_IN
  Top 0.2: IC1.27 62.2,18.6 62.42,18.37 62.43,18.37 62.5,18.3 63.1,18.3 63.64,18.84 66.96,18.84 67.4,18.4 67.4,8.9 66.8,8.3 48.6,8.3 46.86,6.56 X4.2
P2_LED_IN
  Top 0.2: X4.3 48.86,7.12 49.7,7.95 66.95,7.95 67.8,8.8 67.8,18.6 67.21,19.19 63.3,19.19 63.07,18.96 62.6,18.96 IC1.28
P3_LED_IN
  Top 0.2: IC1.29 63.8,19.9 63.96,19.74 67.16,19.74 68.19,18.7 68.19,8.7 67.09,7.6 51.9,7.6 50.86,6.56 X4.4
P4_LED_IN
  Top 0.2: IC1.30 63.9,20.3 64.11,20.09 67.41,20.09 68.55,18.95 68.55,8.55 67.2,7.2 53.9,7.2 52.86,6.16 X4.5
QSPI_SCLK
  Top 0.2: IC1.52 59,36.2 58.4,36.8 57.2,36.8 56.44,36.03 IC3.6
QSPI_SD0
  Top 0.2: IC1.53 58.6,34.2 57.7,35.09 IC3.5
QSPI_SD1
  Top 0.2: IC3.2 55.16,26.93 55.6,26.5 57.1,26.5 57.23,26.63 57.67,26.63 57.8,26.5 IC1.55
QSPI_SD2
  Top 0.2: IC3.3 56.44,27.36 56.72,27.08 57.82,27.08 58.2,26.7 IC1.54
QSPI_SD3
  Top 0.2: IC1.51 59.4,26.54 59.35,26.59 59.35,36.35 58.55,37.15 56.15,37.15 55.16,36.16 IC3.7
QSPI_SS
  Top 0.2: IC1.56 54.46,25.94 53.9,26.5 IC3.1 53,28.4 R11.2 R12.1
R  (via drill 0.35)
  Top 0.2: JP2.3 32.78,6.4 36.3,6.4 47.44,17.54 47.44,23.22 v47.16,23.5 45.5,25.16 45.5,35.9 47.55,37.95 51.97,37.95 52.62,38.6 66,38.6 X9.1 | v49.13,23.27 49.36,23.5 IC1.5
  Bottom 0.2: v47.16,23.5 48.9,23.5 v49.13,23.27
R3
  Top 0.2: IC1.34 64,21.9 64.2,22.1 67.29,22.1 69.7,19.69 69.7,7.9 67.6,5.8 62.9,5.8 61.25,4.15 X1.3
RGB  (via drill 0.35)
  Top 0.2: IC1.18 58.55,19.02 58.55,18.25 57.9,17.6 53.1,17.6 51.05,15.55 47.9,15.55 v47.83,15.47 | v39.62,16.31 39.62,19.08 33.3,25.41 33.3,30.8 32.3,31.79 15.48,31.79 U1.2
  Bottom 0.2: v47.83,15.47 40.46,15.47 v39.62,16.31
RGB_DATA_5V
  Top 0.254: R1.1 12.81,32.92 U1.4
RGB_OUT
  Top 0.2: X15.2 7.5,29.7 9.31,31.51 R1.2
RUN  (via drill 0.35)
  Top 0.2: S1.4 v78.69,6.4 S1.3 | IC1.26 61.8,18.3 62.4,17.7 66.1,17.7 67.04,16.76 67.04,9.84 66.11,8.91 v66.11,8.86
  Bottom 0.2: v78.69,6.4 68.57,6.4 v66.11,8.86
SCL  (via drill 0.35)
  Top 0.2: IC1.39 69.2,23.9
  Top 0.203: 69.2,23.9 69.6,23.5 v69.66,23.43 | v73.6,30.16 72.64,30.16 72.45,30.34
  Top 0.305: X3.5 72.45,33.47 72.45,30.34 R2.2
  Bottom 0.203: v69.66,23.43 73.6,27.37 v73.6,30.16
SDA  (via drill 0.35)
  Top 0.2: IC1.38 68.91,23.5
  Top 0.203: 68.91,23.5 69.66,22.75 v69.66,22.73 | v71.41,30.19 70.48,30.19 R3.2
  Top 0.305: X3.4 70.39,33.53 R3.2
  Bottom 0.203: v69.66,22.73 69.03,23.37 69.03,24 72.2,27.18 72.2,29.4 v71.41,30.19
SEL  (via drill 0.35)
  Top 0.2: JP2.5 30.95,7.11 35.95,7.11 46.66,17.81 46.66,21.79 v46.46,21.99 v46.45,22 46.3,22 46.3,22.01 44.8,23.51 44.8,36.2 47.3,38.7 51.5,38.7 v51.5,38.75 | v49.13,21.95 50.08,21.95 50.83,22.7 IC1.7
  Bottom 0.2: v46.46,21.99 46.88,21.99 46.92,21.95 v49.13,21.95 | v51.5,38.75 52.65,38.75 X10.1
SETTINGS
  Top 0.2: X2.3 71.1,4.67 71.1,22.7 69.5,24.3 IC1.40
START  (via drill 0.35)
  Top 0.2: IC1.8 50.99,22.3 49.93,21.24 v49.83,21.24 | JP2.7 29.16,7.86 35.61,7.86 45.35,17.6 45.35,20.85 v45.8,21.3 44.44,22.66 44.44,36.34 47.2,39.1 50.2,39.1 51.75,40.65 X10.2
  Bottom 0.2: v49.83,21.24 49.77,21.3 v45.8,21.3
SWCLK  (via drill 0.35)
  Top 0.152: IC1.24 61,19.6 60.03,20.57 58.07,20.57 v57.53,20.03
  Top 0.2: v47.3,14.7 50.8,14.7 53.35,17.25 56.8,17.25 57.08,16.97 v57.7,16.97 | v38.8,15.5 38.7,15.6 38.7,18.3 35.5,21.5 X7.2
  Bottom 0.2: v47.3,14.7 39.6,14.7 v38.8,15.5 | v57.53,20.03 57.53,17.14 v57.7,16.97
SWDIO  (via drill 0.35)
  Top 0.2: IC1.25 61.4,20 v61.45,20.05 | v56.45,16.56 56.14,16.56 55.8,16.89 53.49,16.89 50.67,14.07 v46.42,14.07 | v38.15,14.85 38.15,16.65 35.3,19.5 X7.1
  Bottom 0.152: v56.45,16.56 56.45,16.36 56.91,15.9 58.1,15.9 58.83,16.62 58.83,18.32 59.77,19.27 60.67,19.27 v61.45,20.05
  Bottom 0.2: v46.42,14.07 38.93,14.07 v38.15,14.85
TBLED_OUT  (via drill 0.35)
  Top 0.152: IC1.35 63.97,22.3 64.07,22.4 67.85,22.4 70.1,20.16 70.1,7.2 v68.7,5.8
  Bottom 0.152: v68.7,5.8 69.67,4.83 X2.2
TPKEY
  Top 0.2: X1.1 57.25,4.2 59.75,6.7 67.2,6.7 68.9,8.4 68.9,19.1 67.55,20.45 64.25,20.45 64,20.7 IC1.31
U  (via drill 0.35)
  Top 0.2: JP2.1 35.59,4.69 48.15,17.25 48.15,23.85 49.53,25.23 51.46,25.23 v52.09,24.6 v52.1,24.6 52.4,24.3 IC1.3 | v52.2,26.23 51.92,25.95 47.01,25.95 46.2,26.75 46.2,35.5 48,37.29 52.24,37.29 52.85,37.9 72.8,37.9 X8.3
  Bottom 0.2: v52.1,24.6 52.1,26.13 v52.2,26.23
USB_BOOT  (via drill 0.35)
  Top 0.152: S2.4 47.81,29.11
  Top 0.2: R11.1 48.9,29.1 48.88,29.11 47.81,29.11 | X13.1 41.4,29.9 S2.3 42.21,28.21 42.2,28.2 v42.2,28.1 | v47.8,28.1 S2.4
  Bottom 0.2: v42.2,28.1 v47.8,28.1
VBUS  (via drill 0.35)
  Top 0.254: 12.72,31 U1.5 | R14.1 v74.9,31.3
  Top 0.508: JP2.20 JP2.19 14.35,8.29 14.35,11.05 14.03,11.37 4.07,11.37 3.6,11.84 3.6,23.08 6.77,26.25 X15.3 8.28,29.21 C1.2 | C1.2 12.72,31 | U1.5 14,32.19 14,35.6 12.2,37.4 12.2,42.9 13.3,44 82.5,44 83.3,43.2 83.3,41.4 | J6.VBUS 86,23.76 85.25,24.52 85.25,29.85 88.7,33.3 88.7,36 83.3,41.4 | C13.1 72.7,17.5 73.4,18.2 73.4,19.8 v75.4,21.8 | 83.3,41.4 X8.1 | C1.2 12.72,28.42 15.49,25.65 18.92,25.65 20.1,24.47 U$1.2
  Top 0.61: IC2.3 72.19,17.49 C13.1
  Top 0.8: v75.4,21.8 79.78,17.42 X6.5
  Bottom 0.254: v74.9,31.3 74.9,30.68 76.98,28.6
  Bottom 0.8: v75.4,21.8 76.98,23.38 76.98,28.6 78.08,29.7 84.3,29.7 87.02,26.98 J6.VBUS
XIN
  Top 0.152: IC1.20 59.4,17.49 R4.2

### Text on the board
tPlace: USB / BOOT
tNames: RGB LEDS | GP29 / / / GND / / / 3V3 / / / SDA / / / SCL | POWER / LED | RGB | +5V | +5V | DEBUG | GND | BOOT / SEL | Z:/JasensCustoms Branding Resources/jcc-eagle-logo.bmp | 3V3 | SWCLK | SWDIO | IPFB BY JASEN HICKS / WWW.JASENSCUSTOMS.COM / VER 3.0 APRIL 2024 | OPEN SOURCE FIRMWARE / DETAILS AT GP2040-CE.INFO | GND / GND / DN / DP / VBUS | 3.3V | P1 LED | P2 LED | P3 LED | P4 LED | TPKEY | L3 | R3 | GND | TBLED/GPIO 23 | TURBO | 3.3V | RESET | GND
bNames: SPECIAL BETA TESTER THANKS: / THE REAL PHOENIX / NEO702 / Paik4Life / imbord3rlin3 gar3gg3 / Black Majic / WREN